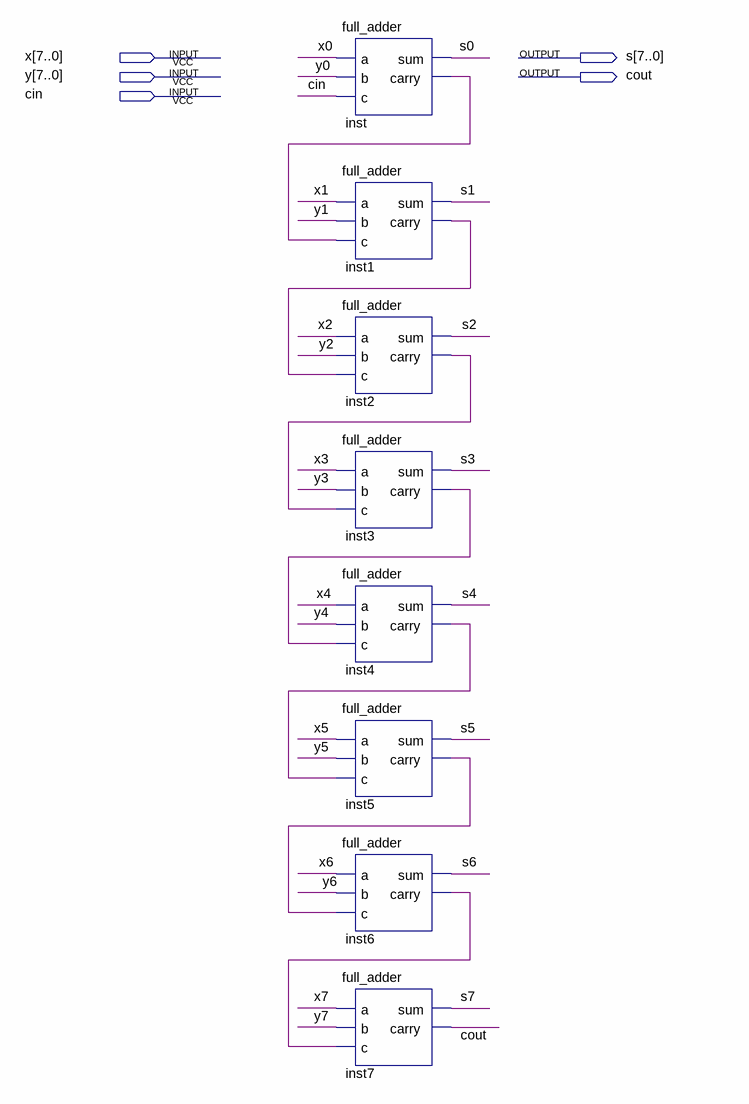
[diagram p0: schematic sheet]
// Quartus schematic somador8bits.bdf as structural Verilog: 8 symbols, 5 pins
module somador8bits (
  input  [7:0] x,
  input  [7:0] y,
  input  cin,
  output [7:0] s,
  output cout
);

  wire inst1_carry, inst2_carry, inst3_carry, inst4_carry, inst5_carry, inst6_carry, inst_carry;

  full_adder inst (.a(x[0]), .b(y[0]), .c(cin), .sum(s[0]), .carry(inst_carry));
  full_adder inst1 (.a(x[1]), .b(y[1]), .c(inst_carry), .sum(s[1]), .carry(inst1_carry));
  full_adder inst2 (.a(x[2]), .b(y[2]), .c(inst1_carry), .sum(s[2]), .carry(inst2_carry));
  full_adder inst3 (.a(x[3]), .b(y[3]), .c(inst2_carry), .sum(s[3]), .carry(inst3_carry));
  full_adder inst4 (.a(x[4]), .b(y[4]), .c(inst3_carry), .sum(s[4]), .carry(inst4_carry));
  full_adder inst5 (.a(x[5]), .b(y[5]), .c(inst4_carry), .sum(s[5]), .carry(inst5_carry));
  full_adder inst6 (.a(x[6]), .b(y[6]), .c(inst5_carry), .sum(s[6]), .carry(inst6_carry));
  full_adder inst7 (.a(x[7]), .b(y[7]), .c(inst6_carry), .sum(s[7]), .carry(cout));
endmodule
